# EAGLE schematic miniprinter z motor mount (EAGLE 9.4.2)
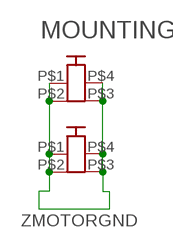
[diagram p0: schematic, sheet 1]

## Parts
CON1  PCB-2M3  [PCB2-M3]
CON7  PCB-2M3  [PCB2-M3]

## Nets
ZMOTORGND: CON1.P$1 CON1.P$2 CON1.P$3 CON1.P$4 CON7.P$1 CON7.P$2 CON7.P$3 CON7.P$4

## Notes on the sheet
- MOUNTING

## Library data of the parts
CON1 CON7 = Screw Terminals:PCB-2M3

## Net classes
0 default: width 0.203 mm, clearance 0.152 mm